# EAGLE design transducer (EAGLE 6.6.0)
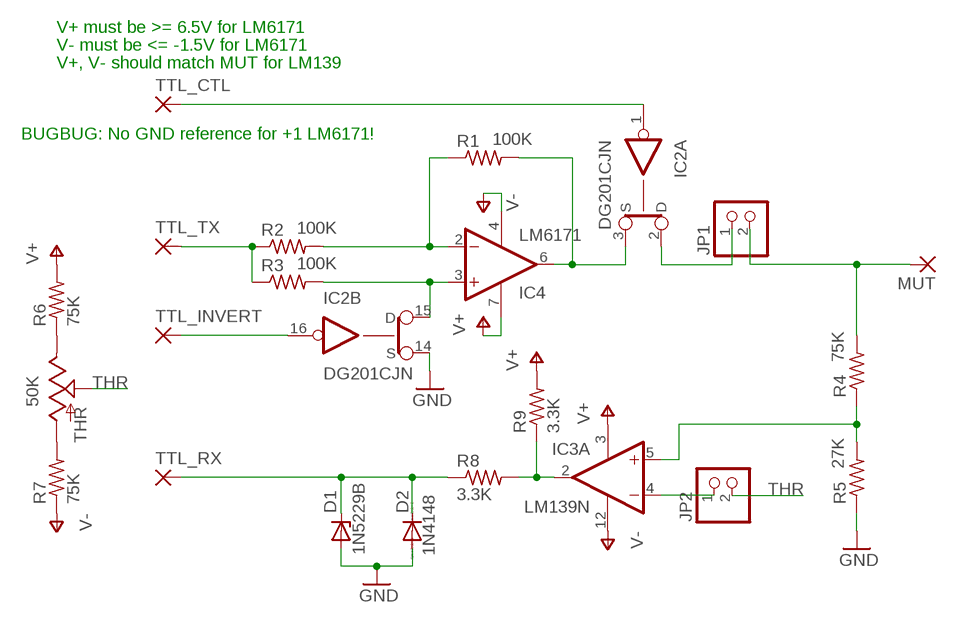
[diagram p0: schematic, sheet 1]

## Parts
D1  1N5229B  ZENER-DIODEDO35Z10  [DO35Z10]
D2  1N4148  1N4148DO35-10  [DO35-10]
IC2  DG201CJN  [DIL16]
IC3  LM139N  LM339N  [DIL14]
IC4  LM6171  1AMP_P7+4N  [DIL08]
JP1  PINHD-1X2  [1X02]
JP2  PINHD-1X2  [1X02]
MUT  1,6/0,9  [1,6/0,9]
R1  100K  R-US_0207/10  [0207/10]
R2  100K  R-US_0207/10  [0207/10]
R3  100K  R-US_0207/10  [0207/10]
R4  75K  R-US_0207/10  [0207/10]
R5  27K  R-US_0207/10  [0207/10]
R6  75K  R-US_0207/10  [0207/10]
R7  75K  R-US_0207/10  [0207/10]
R8  3.3K  R-US_0207/10  [0207/10]
R9  3.3K  R-US_0207/10  [0207/10]
THR  50K  TRIM_US-S43P  [SP19L]
TTL_CTL  1,6/0,9  [1,6/0,9]
TTL_INVERT  1,6/0,9  [1,6/0,9]
TTL_RX  1,6/0,9  [1,6/0,9]
TTL_TX  1,6/0,9  [1,6/0,9]

## Nets
GND: D1.A D2.A IC2.14(B:S) R5.1
N$1: R2.1 R3.1 TTL_TX.1(P)
N$2: IC2.15(B:D) IC4.3(+IN) R3.2
N$3: IC4.2(-IN) R1.1 R2.2
N$4: IC2.3(A:S) IC4.6(OUT) R1.2
N$5: IC2.2(A:D) JP1.1
N$6: JP1.2 MUT.1(P) R4.2
N$7: IC3.5(A:+IN) R4.1 R5.2
N$8: IC3.4(A:-IN) JP2.1
N$9: IC3.2(A:OUT) R8.2 R9.1
N$10: IC2.16(B:IN) TTL_INVERT.1(P)
N$11: IC2.1(A:IN) TTL_CTL.1(P)
N$12: D1.C D2.C R8.1 TTL_RX.1(P)
N$13: R6.1 THR.E
N$14: R7.2 THR.A
THR: JP2.2 THR.S
V+: IC3.3(P:V+) IC4.7(V+) R6.2 R9.2
V-: IC3.12(P:GND) IC4.4(V-) R7.1
Unconnected: IC2.6(D:S) IC2.7(D:D) IC2.8(D:IN) IC2.9(C:IN) IC2.10(C:D) IC2.11(C:S) IC3.1(B:OUT) IC3.6(B:-IN) IC3.7(B:+IN) IC3.8(C:-IN) IC3.9(C:+IN) IC3.10(D:-IN) IC3.11(D:+IN) IC3.13(D:OUT) IC3.14(C:OUT)

## Notes on the sheet
- V+ must be >= 6.5V for LM6171
- V- must be <= -1.5V for LM6171
- V+, V- should match MUT for LM139
- BUGBUG: No GND reference for +1 LM6171!

## Power pins joined to a net without a drawn wire
GND: IC2.5(P:GND)
V+: IC2.13(P:V+)
V-: IC2.4(P:V-)

## Library data of the parts
D1 = diode:ZENER-DIODE: Z-Diode
D2 = diode:1N4148: DIODE high speed (Philips)
IC2 = linear:DG201CJ: CMOS SWITCH
IC3 = linear:LM339: Low Power Low Offset Voltage Quad Comparators with open collector; LM139/LM239/LM339/LM2901/LM3302
IC4 = linear:1AMP_P7+4: OP AMP
JP1 JP2 = pinhead:PINHD-1X2: PIN HEADER
MUT TTL_CTL TTL_INVERT TTL_RX TTL_TX = wirepad:1,6/0,9: THROUGH-HOLE PAD
R1-R9 = rcl:R-US_: RESISTOR, American symbol
THR = pot:TRIM_US-: POTENTIOMETER

## Board
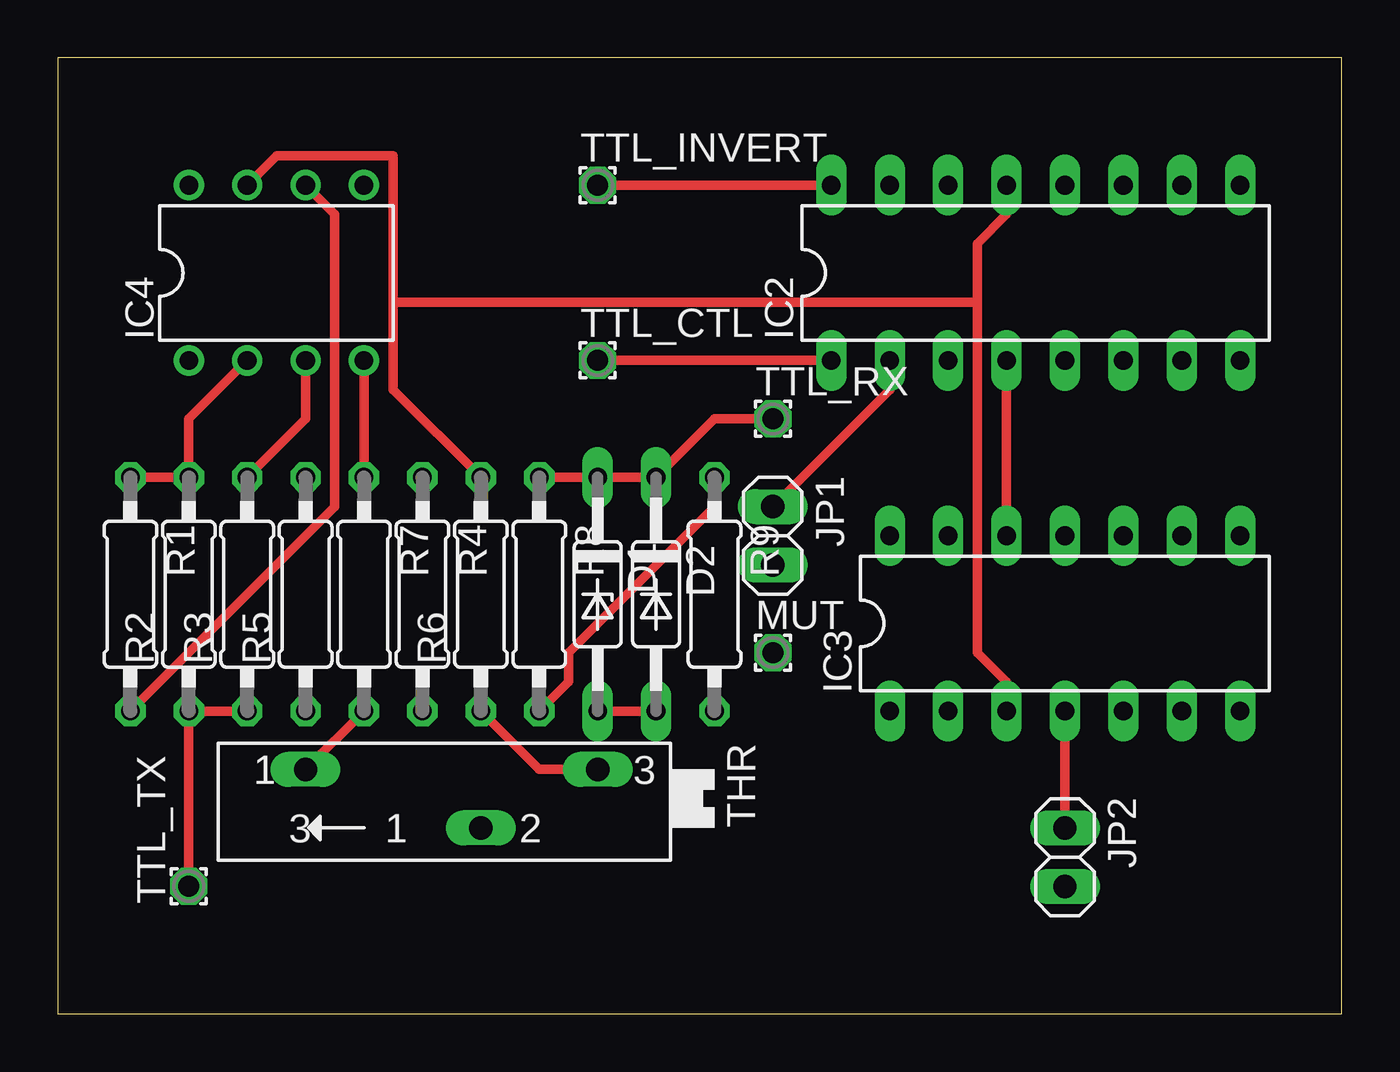
[diagram p1: board, top side]
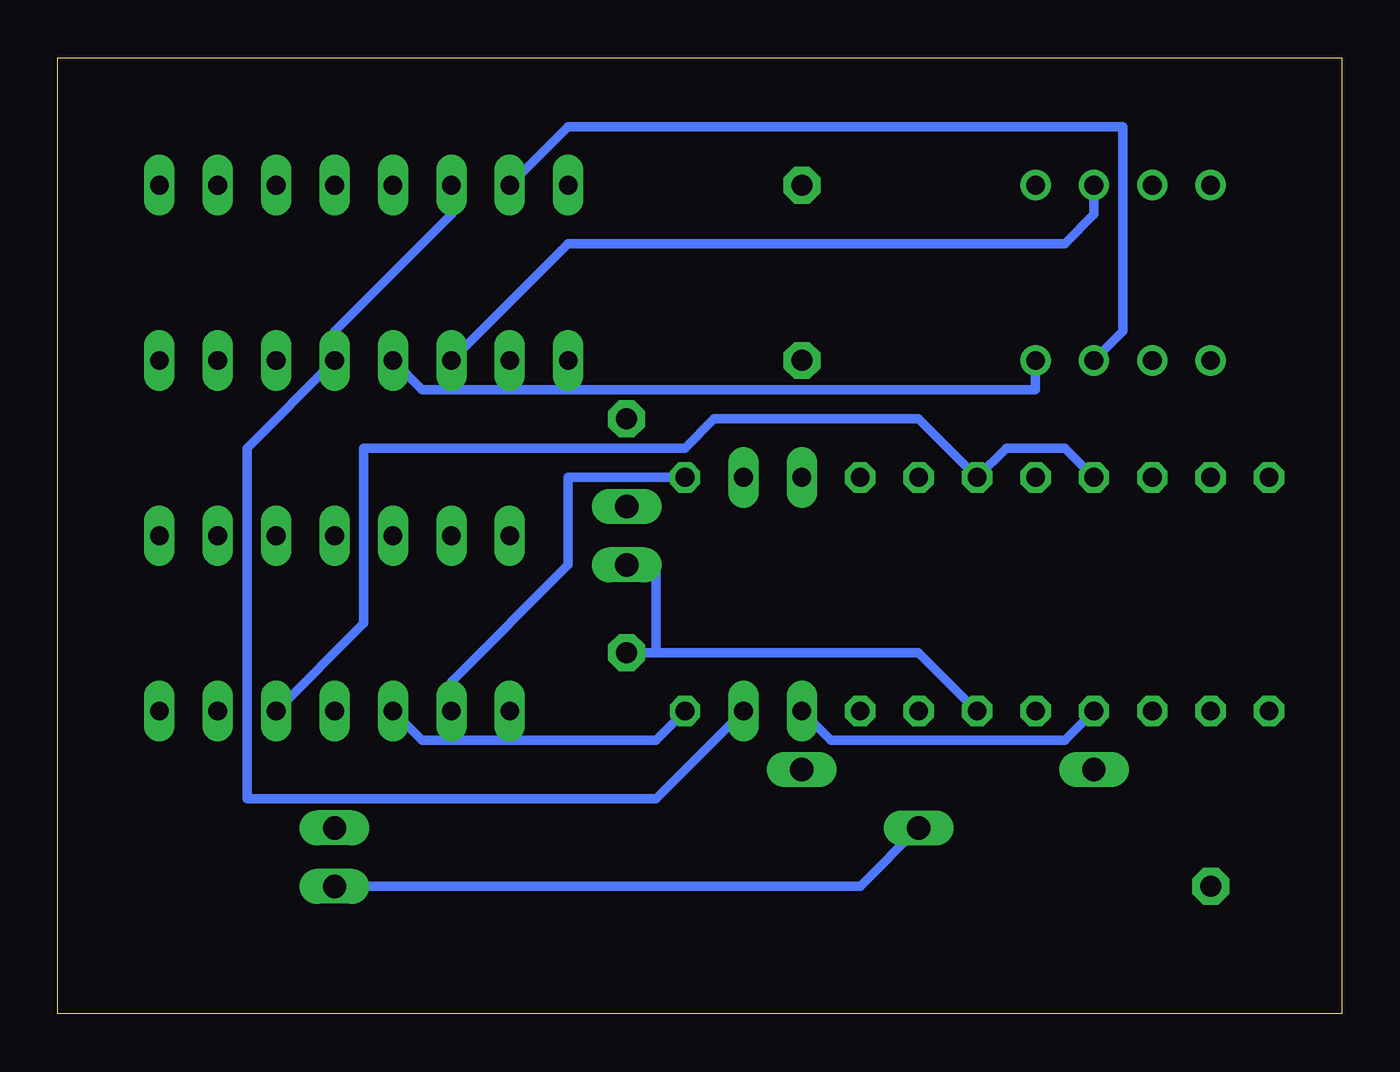
[diagram p2: board, bottom side, seen from below]

Size 55.86 x 41.58 mm. Coordinates in mm from the lower left corner, seen from the top.
Outline: 0,0 55.86,0 55.86,41.58 0,41.58 0,0
Copper layers (1+16): Top 0.035mm / dielectric 1.5mm / Bottom 0.035mm
Design rules "16mils": minimum track width 16mil, minimum drill 32mil, track to track 15mil, track to pad 10mil, pad to pad 10mil, via to via 10mil, smd to smd 10mil, copper to edge 13mil, drill to drill 10mil, minimum pad ring 10mil, minimum via ring 8mil, stop-mask expansion 0mil, vias tented up to drill 0mil, thermal gap 10mil

### Footprints (pad centres in the part's own frame; a part is rotated, then mirrored left to right if it is on the bottom)
DO35Z10 = drill 0.813 long: A 5.08,0; C -5.08,0
DO35-10 = drill 0.813 long: A 5.08,0; C -5.08,0
DIL16 = drill 0.813 long: 1 -8.89,-3.81; 2 -6.35,-3.81; 3 -3.81,-3.81; 4 -1.27,-3.81; 5 1.27,-3.81; 6 3.81,-3.81; 7 6.35,-3.81; 8 8.89,-3.81; 9 8.89,3.81; 10 6.35,3.81; 11 3.81,3.81; 12 1.27,3.81; 13 -1.27,3.81; 14 -3.81,3.81; 15 -6.35,3.81; 16 -8.89,3.81
DIL14 = drill 0.813 long: 1 -7.62,-3.81; 2 -5.08,-3.81; 3 -2.54,-3.81; 4 0,-3.81; 5 2.54,-3.81; 6 5.08,-3.81; 7 7.62,-3.81; 8 7.62,3.81; 9 5.08,3.81; 10 2.54,3.81; 11 0,3.81; 12 -2.54,3.81; 13 -5.08,3.81; 14 -7.62,3.81
DIL08 = drill 0.813 pad 1.27: 1 -3.81,-3.81; 2 -1.27,-3.81; 3 1.27,-3.81; 4 3.81,-3.81; 5 3.81,3.81; 6 1.27,3.81; 7 -1.27,3.81; 8 -3.81,3.81
1X02 = drill 1.016 long: 1 -1.27,0; 2 1.27,0
1,6/0,9 = drill 0.914 pad 1.6 octagon: 1 0,0
0207/10 = drill 0.813 octagon: 1 -5.08,0; 2 5.08,0
SP19L = drill 1.016 long: A 5.715,-1.27; E -6.985,-1.27; S -1.905,1.27

### Placement (x,y rotation side)
D1  23.49,18.25 270 top
D2  26.03,18.25 270 top
IC2  42.54,32.22 0 top
IC3  43.81,16.98 0 top
IC4  9.52,32.22 0 top
JP1  31.11,20.79 270 top
JP2  43.81,6.82 270 top
MUT  31.11,15.71 0 top
R1  3.17,18.25 270 top
R2  5.71,18.25 90 top
R3  8.25,18.25 90 top
R4  15.87,18.25 270 top
R5  10.79,18.25 90 top
R6  18.41,18.25 90 top
R7  13.33,18.25 270 top
R8  20.95,18.25 270 top
R9  28.57,18.25 270 top
THR  16.5,9.36 180 top
TTL_CTL  23.49,28.41 0 top
TTL_INVERT  23.49,36.03 0 top
TTL_RX  31.11,25.87 0 top
TTL_TX  5.71,5.55 90 top

### Tracks (layer width: path | path; a pad name or v marks a point on that pad's centre or on a via)
GND
  Top 0.406: D1.A D2.A
  Bottom 0.406: IC2.14 38.73,34.76 43.81,29.68 IC2.5 47.62,24.6 47.62,9.36 29.84,9.36 D2.A | R5.1 12.06,11.9 22.22,11.9 D1.A
N$1
  Top 0.406: R3.1 R2.1 TTL_TX.1
N$2
  Top 0.406: R3.2 10.79,25.87 IC4.3
  Bottom 0.406: IC4.3 9.52,29.68 9.52,38.57 33.65,38.57 IC2.15
N$3
  Top 0.406: R1.1 R2.2 5.71,25.87 IC4.2
N$4
  Top 0.406: R1.2 12.06,22.06 12.06,34.76 IC4.6
  Bottom 0.406: IC2.3 33.65,33.49 12.06,33.49 10.79,34.76 IC4.6
N$5
  Top 0.406: JP1.1 36.19,27.14 IC2.2
N$6
  Bottom 0.406: R4.2 18.41,15.71 29.84,15.71 | 29.84,15.71 MUT.1 | 29.84,15.71 29.84,19.52 JP1.2
N$7
  Bottom 0.406: R5.2 12.06,24.6 14.6,24.6 R4.1 18.41,25.87 27.3,25.87 28.57,24.6 42.54,24.6 42.54,16.98 IC3.5
N$8
  Top 0.406: JP2.1 43.81,11.9 IC3.4
N$9
  Top 0.406: R8.2 22.22,14.44 22.22,15.71 28.57,22.06 R9.1
  Bottom 0.406: R9.1 33.65,23.33 33.65,19.52 38.73,14.44 IC3.2
N$10
  Top 0.406: TTL_INVERT.1 IC2.16
N$11
  Top 0.406: TTL_CTL.1 IC2.1
N$12
  Top 0.406: R8.1 D1.C D2.C 28.57,25.87 TTL_RX.1
N$13
  Top 0.406: R6.1 20.95,10.63 22.22,10.63 THR.E
N$14
  Top 0.406: THR.A R7.2
THR
  Bottom 0.406: THR.S 20.95,5.55 JP2.2
V+
  Top 0.406: R6.2 14.6,27.14 14.6,30.95 | 14.6,30.95 14.6,37.3 9.52,37.3 IC4.7 | 40,30.95 40,15.71 41.27,14.44 IC3.3 | 40,30.95 40,33.49 41.27,34.76 IC2.13 | 14.6,30.95 40,30.95
  Bottom 0.406: R9.2 29.84,11.9 40,11.9 IC3.3
V-
  Top 0.406: R7.1 IC4.4 | IC2.4 IC3.12
  Bottom 0.406: IC2.4 40,27.14 13.33,27.14 IC4.4